# EasyEDA schematic SCH_模电课设_2024-01-21.json
TITLE: Sheet_1; REV: 1.0; Date: 2023-03-11; Sheet: 1/1; Drawn By: baldman12; Company: Your Company
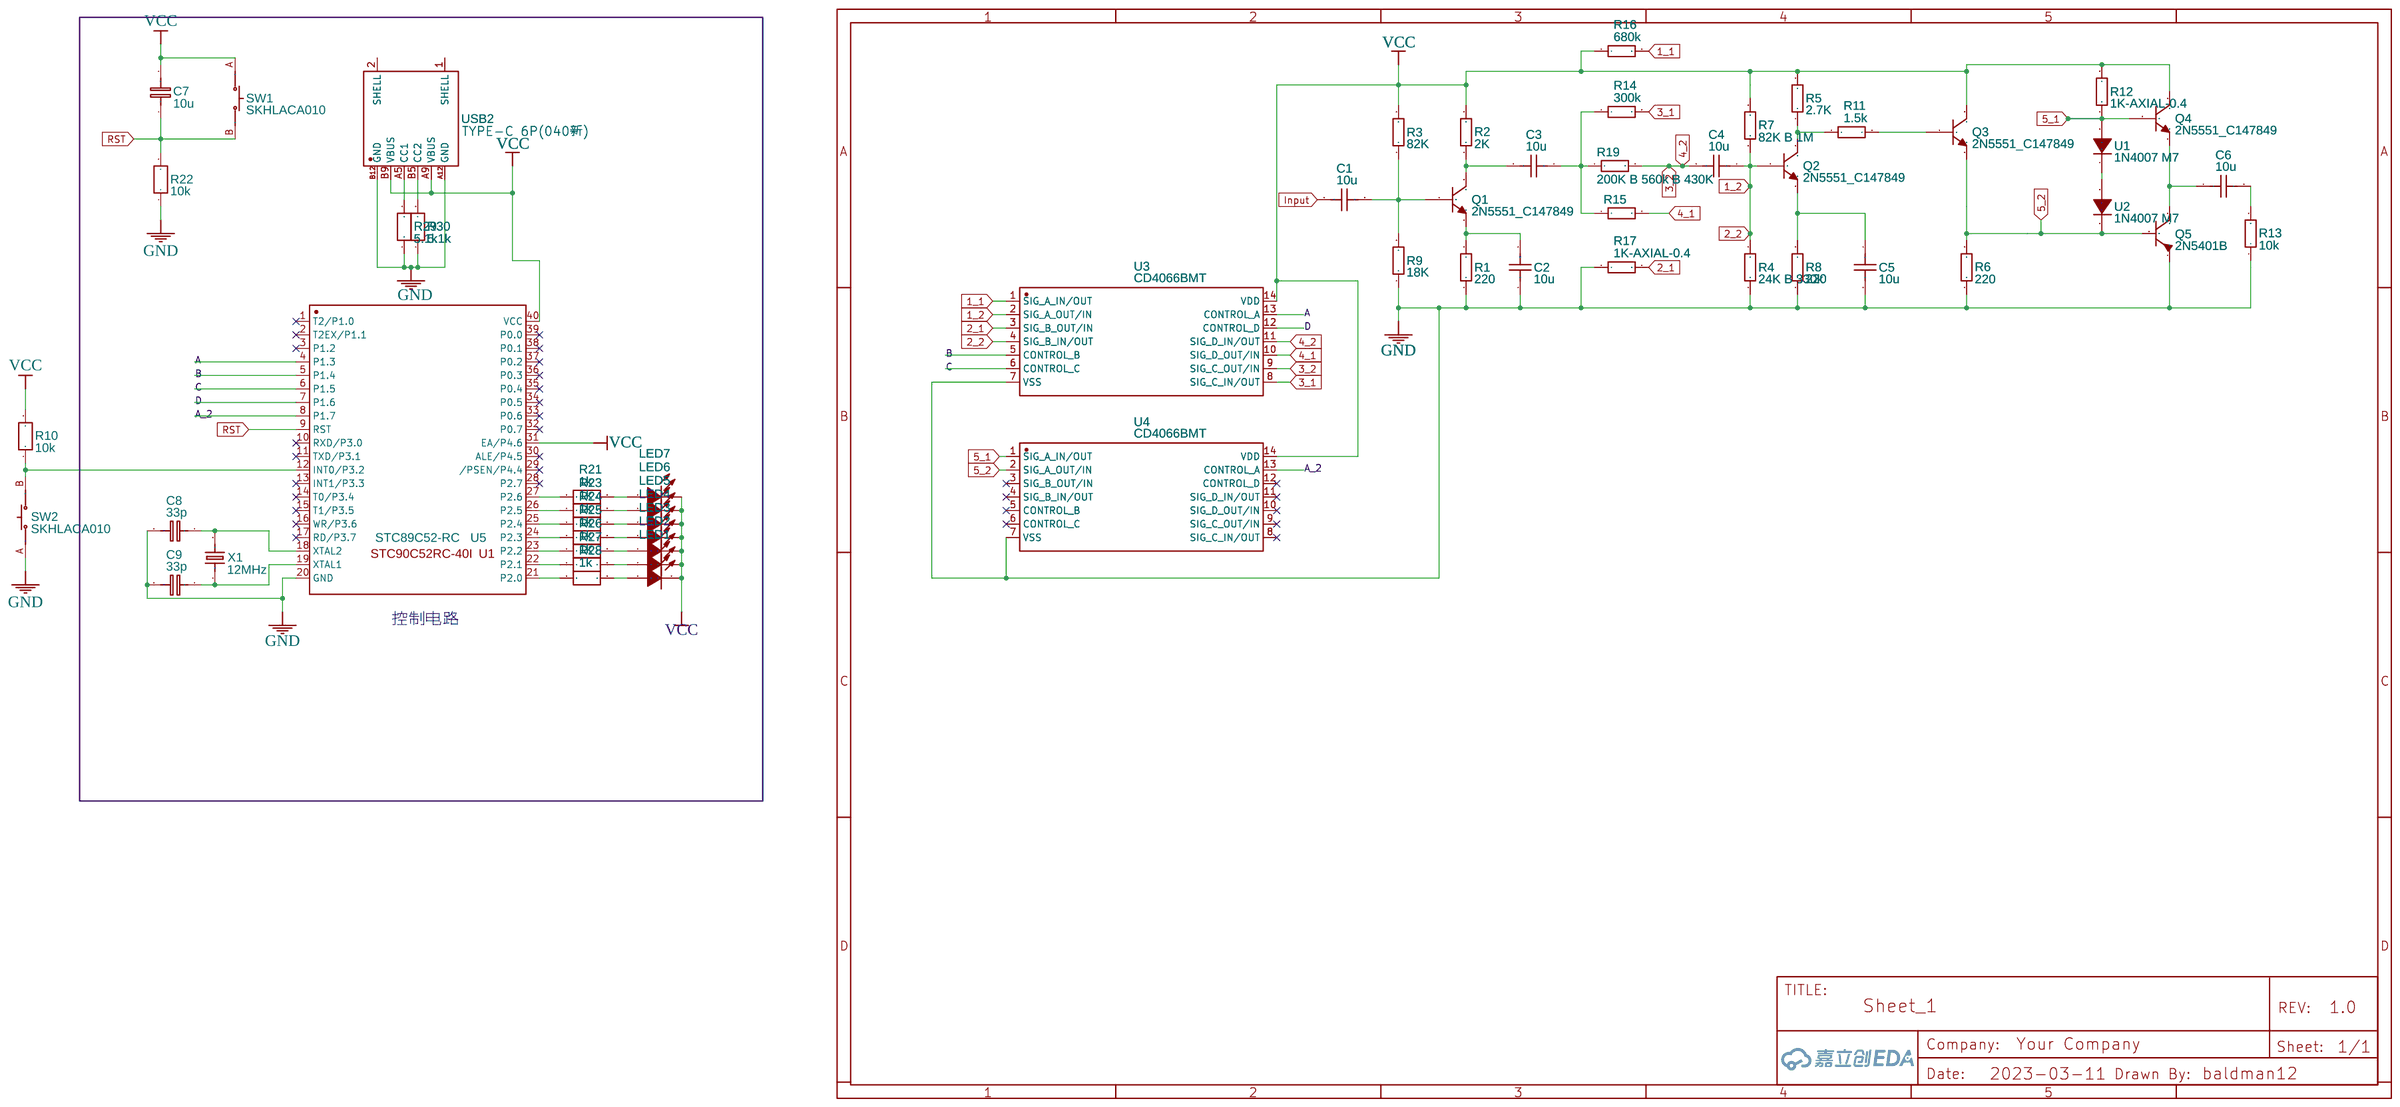
[diagram p0: schematic sheet]

## Parts
C1  10u  [C0603]
C2  10u  [C0603]
C3  10u  [C0603]
C4  10u  [C0603]
C5  10u  [C0603]
C6  10u  [C0603]
C7  10u  [C0603]
C8  33p  [C0603]
C9  33p  [C0603]
LED1  204-10SURC/S530-A3-L  [LED-TH_BD3.8-P2.54-FD]
LED2  204-10SURC/S530-A3-L  [LED-TH_BD3.8-P2.54-FD]
LED3  204-10SURC/S530-A3-L  [LED-TH_BD3.8-P2.54-FD]
LED4  204-10SURC/S530-A3-L  [LED-TH_BD3.8-P2.54-FD]
LED5  204-10SURC/S530-A3-L  [LED-TH_BD3.8-P2.54-FD]
LED6  204-10SURC/S530-A3-L  [LED-TH_BD3.8-P2.54-FD]
LED7  204-10SURC/S530-A3-L  [LED-TH_BD3.8-P2.54-FD]
Q1  2N5551_C147849  [TO-92-3_L4.9-W3.7-P1.27-L]
Q2  2N5551_C147849  [TO-92-3_L4.9-W3.7-P1.27-L]
Q3  2N5551_C147849  [TO-92-3_L4.9-W3.7-P1.27-L]
Q4  2N5551_C147849  [TO-92-3_L4.9-W3.7-P1.27-L]
Q5  2N5401B  [TO-92-3_L4.9-W3.7-P1.27-L]
R1  220  [RES-TH_BD3.2-L9.0-P13.00-D0.5]
R2  2K  [RES-TH_BD3.2-L9.0-P13.00-D0.5]
R3  82K  [RES-TH_BD3.2-L9.0-P13.00-D0.5]
R4  24K B 330k  [RES-TH_BD3.2-L9.0-P13.00-D0.5]
R5  2.7K  [RES-TH_BD3.2-L9.0-P13.00-D0.5]
R6  220  [RES-TH_BD3.2-L9.0-P13.00-D0.5]
R7  82K B 1M  [RES-TH_BD3.2-L9.0-P13.00-D0.5]
R8  220  [RES-TH_BD3.2-L9.0-P13.00-D0.5]
R9  18K  [RES-TH_BD3.2-L9.0-P13.00-D0.5]
R10  10k  [R0603]
R11  1.5k  [RES-TH_BD3.2-L9.0-P13.00-D0.5]
R12  1K-AXIAL-0.4  [RES-TH_BD3.2-L9.0-P13.00-D0.5]
R13  10k  [RES-TH_BD3.2-L9.0-P13.00-D0.5]
R14  300k  [RES-TH_BD3.2-L9.0-P13.00-D0.5]
R15  1K-AXIAL-0.4  [RES-TH_BD3.2-L9.0-P13.00-D0.5]
R16  680k  [RES-TH_BD3.2-L9.0-P13.00-D0.5]
R17  1K-AXIAL-0.4  [RES-TH_BD3.2-L9.0-P13.00-D0.5]
R19  200K B 560k B 430K  [RES-TH_BD3.2-L9.0-P13.00-D0.5]
R21  1k  [R0603]
R22  10k  [R0603]
R23  1k  [R0603]
R24  1k  [R0603]
R25  1k  [R0603]
R26  1k  [R0603]
R27  1k  [R0603]
R28  1k  [R0603]
R29  5.1k  [R0603]
R30  5.1k  [R0603]
SW1  SKHLACA010  [SW-TH_L6.0-W3.5-LS6.6]
SW2  SKHLACA010  [SW-TH_L6.0-W3.5-LS6.6]
U1  1N4007 M7  [SMA_L4.2-W2.7-LS5.3-RD]
U2  1N4007 M7  [SMA_L4.2-W2.7-LS5.3-RD]
U3  CD4066BMT  [SOIC-14_L8.7-W3.9-P1.27-LS6.0-BL]
U4  CD4066BMT  [SOIC-14_L8.7-W3.9-P1.27-LS6.0-BL]
U5  STC89C52-RC  [STC89C52-RC]
USB2  TYPE-C 6P(040新)  [USB-C-SMD_TYPE-C-6P]
X1  12MHz  [HC-49US_L11.5-W4.5-P4.88]

## Library data of the parts
C1-C6 = C_0603_US: Contributor: LCEDA_Lib
C7-C9 = C_0603_EU: Contributor: LCEDA_Lib
LED1-LED7 = 204-10SURC/S530-A3-L: Supplier: LCSC; Supplier Part: C264302; Manufacturer: EVERLIGHT(亿光); Contributor: LCSC; JLCPCB Part Class: Extended Part
Q1-Q4 = 2N5551_C147849: Supplier: LCSC; Manufacturer: CJ(江苏长电/长晶); Manufacturer Part: 2N5551; Contributor: 立创EDA官方封装库; Supplier Part: C147849; JLCPCB Part Class: Extended Part
Q5 = 2N5401B: Supplier: LCSC; Supplier Part: C438646; Manufacturer: FeiHong(飞虹); Contributor: LCSC; JLCPCB Part Class: Extended Part
R1-R9 R11-R17 R19 = 1K-AXIAL-0.4: Supplier: LCSC; Supplier Part: C9900024064; Manufacturer: null; JLCPCB Part Class: Extended Part; Contributor: lcsc
R10 R21-R30 = R_0603_EU: Contributor: LCEDA_Lib
SW1 SW2 = SKHLACA010: Supplier: LCSC; Supplier Part: C382056; Manufacturer: ALPSALPINE(阿尔卑斯阿尔派); Contributor: LCSC; JLCPCB Part Class: Extended Part
U1 U2 = 1N4007 M7: Supplier: LCSC; Supplier Part: C2895256; Manufacturer: null; JLCPCB Part Class: Extended Part; Contributor: LCSC
U3 U4 = CD4066BMT: Supplier: LCSC; Supplier Part: C2871982; Manufacturer: TI(德州仪器); link: https://atta.szlcsc.comnull; Contributor: LCSC
U5 = STC89C52-RC: Contributor: BaiYang007
USB2 = TYPE-C 6P(040新): Contributor: LCSC; Supplier: LCSC; Supplier Part: C2887422; Manufacturer: SHOU HAN(首韩); JLCPCB Part Class: Extended Part
X1 = HC-49S12MHZ20PF30PPM: Supplier: LCSC; Manufacturer: TAE(雅晶鑫); Manufacturer Part: TAXD12M2GLFBET2T; Contributor: LCSC; Supplier Part: C127674; JLCPCB Part Class: Extended Part

## Nets
GND: C2.1 C5.2 C8.2 C9.2 Q5.1(E) R1.1 R4.1 R6.1 R8.1 R9.1 R13.1 R17.1 R22.1 R29.1 R30.1 SW2.A U3.7(VSS) U4.7(VSS) U5.20(GND) USB2.A12(GND) USB2.B12(GND)
VCC: C7.2 LED1.2(K) LED2.2(K) LED3.2(K) LED4.2(K) LED5.2(K) LED6.2(K) LED7.2(K) Q3.3(C) Q4.3(C) R2.2 R3.2 R5.2 R7.2 R10.2 R12.2 R16.1 SW1.A U3.14(VDD) U4.14(VDD) U5.31(EA/P4.6) U5.40(VCC) USB2.A9(VBUS) USB2.B9(VBUS)
1_1: R16.2 U3.1(SIG A IN/OUT)
1_2: C4.1 Q2.2(B) R4.2 R7.1 U3.2(SIG A OUT/IN) U3.4(SIG B IN/OUT)
2_1: R17.2 U3.3(SIG B OUT/IN)
3_1: R14.2 U3.8(SIG C IN/OUT)
3_2: C4.2 R19.2 U3.9(SIG C OUT/IN) U3.11(SIG D IN/OUT)
4_1: R15.2 U3.10(SIG D OUT/IN)
5_1: Q4.2(B) R12.1 U1.2(A) U4.1(SIG A IN/OUT)
5_2: Q3.1(E) Q5.2(B) R6.2 U2.1(K) U4.2(SIG A OUT/IN)
A: U3.13(CONTROL A) U5.4(P1.3)
A_2: U4.13(CONTROL A) U5.8(P1.7)
B: U3.5(CONTROL B) U5.5(P1.4)
C: U3.6(CONTROL C) U5.6(P1.5)
D: U3.12(CONTROL D) U5.7(P1.6)
Input: C1.1
RST: C7.1 R22.2 SW1.B U5.9(RST)
Net-(C1-2): C1.2 Q1.2(B) R3.1 R9.2
Net-(C2-2): C2.2 Q1.1(E) R1.2
Net-(C3-1): C3.1 R14.1 R15.1 R19.1
Net-(C3-2): C3.2 Q1.3(C) R2.1
Net-(C5-1): C5.1 Q2.1(E) R8.2
Net-(C6-1): C6.1 Q4.1(E) Q5.3(C)
Net-(C6-2): C6.2 R13.2
Net-(C8-1): C8.1 U5.18(XTAL2) X1.2
Net-(C9-1): C9.1 U5.19(XTAL1) X1.1
Net-(LED1-1): LED1.1(A) R28.2
Net-(LED2-1): LED2.1(A) R27.2
Net-(LED3-1): LED3.1(A) R26.2
Net-(LED4-1): LED4.1(A) R25.2
Net-(LED5-1): LED5.1(A) R24.2
Net-(LED6-1): LED6.1(A) R23.2
Net-(LED7-1): LED7.1(A) R21.2
Net-(Q2-3): Q2.3(C) R5.1 R11.1
Net-(Q3-2): Q3.2(B) R11.2
Net-(R10-1): R10.1 SW2.B U5.12(INT0/P3.2)
Net-(R21-1): R21.1 U5.27(P2.6)
Net-(R23-1): R23.1 U5.26(P2.5)
Net-(R24-1): R24.1 U5.25(P2.4)
Net-(R25-1): R25.1 U5.24(P2.3)
Net-(R26-1): R26.1 U5.23(P2.2)
Net-(R27-1): R27.1 U5.22(P2.1)
Net-(R28-1): R28.1 U5.21(P2.0)
Net-(R29-2): R29.2 USB2.A5(CC1)
Net-(R30-2): R30.2 USB2.B5(CC2)
Net-(U1-1): U1.1(K) U2.2(A)

Not connected (* = marked no-connect by the designer): U4 3(SIG B OUT/IN)* 4(SIG B IN/OUT)* 5(CONTROL B)* 6(CONTROL C)* 8(SIG C IN/OUT)* 9(SIG C OUT/IN)* 10(SIG D OUT/IN)* 11(SIG D IN/OUT)* 12(CONTROL D)*; U5 1(T2/P1.0)* 2(T2EX/P1.1)* 3(P1.2)* 10(RXD/P3.0)* 11(TXD/P3.1)* 13(INT1/P3.3)* 14(T0/P3.4)* 15(T1/P3.5)* 16(WR/P3.6)* 17(RD/P3.7)* 28(P2.7)* 29(/PSEN/P4.4)* 30(ALE/P4.5)* 32(P0.7)* 33(P0.6)* 34(P0.5)* 35(P0.4)* 36(P0.3)* 37(P0.2)* 38(P0.1)* 39(P0.0)*; USB2 1(SHELL) 2(SHELL)

## Notes on the sheet
- 控制电路
